# EAGLE design OpenSprinkler_v12 (EAGLE 5.11)
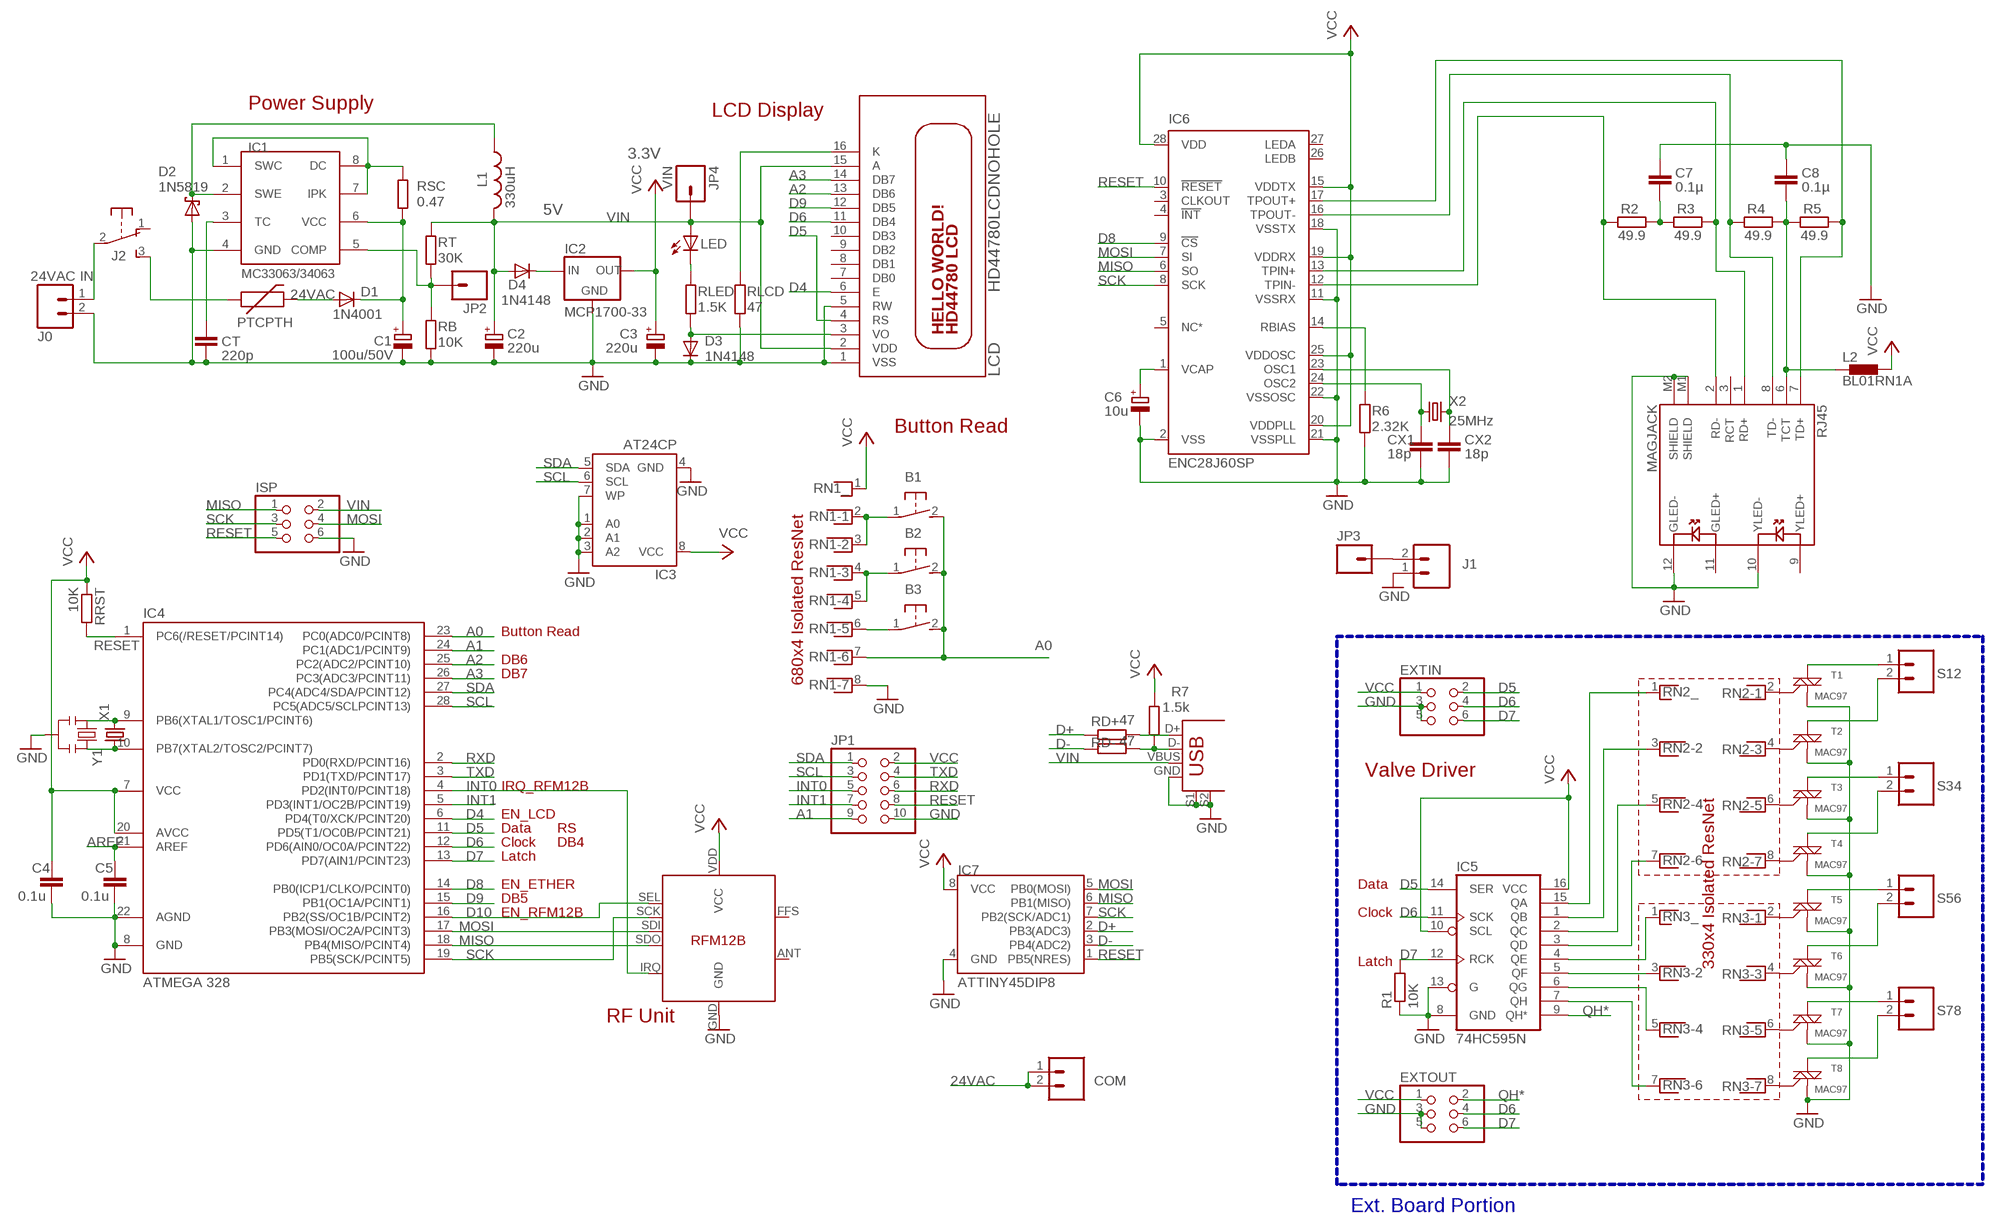
[diagram p0: schematic, sheet 1]

## Parts
B1  31-XX  [B3F-31XX]
B2  31-XX  [B3F-31XX]
B3  31-XX  [B3F-31XX]
C1  100u/50V  CPOL-EUE3.5-8  [E3,5-8]
C2  220u  CPOL-EUE2-5  [E2-5]
C3  220u  CPOL-EUE2-5  [E2-5]
C4  0.1u  C-EU025-024X044  [C025-024X044]
C5  0.1u  C-EU025-024X044  [C025-024X044]
C6  10u  CPOL-EUE1.8-4  [E1,8-4]
C7  0.1µ  C-EU025-024X044  [C025-024X044]
C8  0.1µ  C-EU025-024X044  [C025-024X044]
COM  M025MM  [SCREWTERMINAL-5MM-2]
CT  220p  C-EU025-024X044  [C025-024X044]
CX1  18p  C-EU025-024X044  [C025-024X044]
CX2  18p  C-EU025-024X044  [C025-024X044]
D1  1N4001  DIODE-DO41-7.6  [DO41-7.6]
D2  1N5819  1N5817-B  [DO41-7.6]
D3  1N4148  1N4148DO35-7  [DO35-7]
D4  1N4148  1N4148DO35-7  [DO35-7]
EXTIN  PINHD-2X3  [2X03]
EXTOUT  PINHD-2X3  [2X03]
IC1  MC33063/MC34063P  [DIL08]
IC2  MCP1700-33  MCP1700INLINE  [TO92-INLINE]
IC3  AT24CP  [DIL08]
IC4  ATMEGA 328  ATMEGA48/88/168-PU  [DIL28-3]
IC5  74HC595N  74LS595N  [DIL16]
IC6  ENC28J60SP  [DIL28-3]
IC7  ATTINY45DIP8  [DIP08]
IC8  RFM12B  [RFM12B]
ISP  PINHD-2X3  [2X03]
J0  24VAC IN  M025MM  [SCREWTERMINAL-5MM-2]
J1  M025MM  [SCREWTERMINAL-5MM-2]
J2  EG1206  [EG1206]
JP1  PINHD-2X5  [2X05]
JP2  M01PTH  [1X01]
JP3  M01PTH  [1X01]
JP4  VIN  M01PTH  [1X01]
L1  330uH  L-US6000-XXX-RC  [6000-XXXX-RC]
L2  BL01RN1A  [BL01RN1A]
LCD  HD44780LCDNOHOLE  [LCD1602A]
LED  POWERLED  LED3MM  [LED3MM]
PTC  PTCPTH  [PTC]
R1  10K  R-EU_0204/7  [0204/7]
R2  49.9  R-EU_0204/7  [0204/7]
R3  49.9  R-EU_0204/7  [0204/7]
R4  49.9  R-EU_0204/7  [0204/7]
R5  49.9  R-EU_0204/7  [0204/7]
R6  2.32K  R-EU_0204/7  [0204/7]
R7  1.5k  R-EU_0204/7  [0204/7]
RB  10K  R-EU_0204/7  [0204/7]
RD+  47  R-EU_0204/7  [0204/7]
RD-  47  R-EU_0204/7  [0204/7]
RJ45  MAGJACK  [MAGJACK]
RLCD  47  R-EU_0204/7  [0204/7]
RLED  1.5K  R-EU_0204/7  [0204/7]
RN1  RNX7  [RN-8]
RN2  RNX7  [RN-8]
RN3  RNX7  [RN-8]
RRST  10K  R-EU_0204/7  [0204/7]
RSC  0.47  R-EU_0204/2V  [0204V]
RT  30K  R-EU_0204/7  [0204/7]
S12  M025MM  [SCREWTERMINAL-5MM-2]
S34  M025MM  [SCREWTERMINAL-5MM-2]
S56  M025MM  [SCREWTERMINAL-5MM-2]
S78  M025MM  [SCREWTERMINAL-5MM-2]
T1  MAC97  LX807DE  [TO-92]
T2  MAC97  LX807DE  [TO-92]
T3  MAC97  LX807DE  [TO-92]
T4  MAC97  LX807DE  [TO-92]
T5  MAC97  LX807DE  [TO-92]
T6  MAC97  LX807DE  [TO-92]
T7  MAC97  LX807DE  [TO-92]
T8  MAC97  LX807DE  [TO-92]
USB  USB+SHIELD  [USB-B-PTH]
X1  CRYSTALTC26V  [TC26V]
X2  25MHz  CRYSTALHC49US  [HC49US]
Y1  RESONATORPTH  [RESONATOR-PTH]

## Nets
24VAC [power]: COM.1 COM.2 D1.A PTC.P$2
A0: B1.2(S) B2.2(S) B3.2(S) IC4.23(PC0(ADC0/PCINT8)) RN1.7
A1: IC4.24(PC1(ADC1/PCINT9)) JP1.9
A2: IC4.25(PC2(ADC2/PCINT10)) LCD.13(DB6)
A3: IC4.26(PC3(ADC3/PCINT11)) LCD.14(DB7)
AREF: C5.1 IC4.21(AREF)
D4: IC4.6(PD4(T0/XCK/PCINT20)) LCD.6(E)
D5: EXTIN.2 IC4.11(PD5(T1/OC0B/PCINT21)) IC5.14(SER) LCD.4(RS)
D6: EXTIN.4 EXTOUT.4 IC4.12(PD6(AIN0/OC0A/PCINT22)) IC5.11(SCK) LCD.11(DB4)
D7: EXTIN.6 EXTOUT.6 IC4.13(PD7(AIN1/PCINT23)) IC5.12(RCK) R1.2
D8: IC4.14(PB0(ICP1/CLKO/PCINT0)) IC6.9(!CS)
D9: IC4.15(PB1(OC1A/PCINT1)) LCD.12(DB5)
D10: IC4.16(PB2(SS/OC1B/PCINT2)) IC8.SEL
D+: IC7.2(PB3(ADC3)) RD+.1
D-: IC7.3(PB4(ADC2)) RD-.1
GND [power]: C1.- C2.- C3.- C4.2 C5.2 C6.- C7.1 C8.1 CT.2 CX1.2 CX2.2 D2.A D3.C EXTIN.3 EXTIN.5 EXTOUT.3 EXTOUT.5 IC1.4(GND) IC2.1(GND) IC3.1(A0) IC3.2(A1) IC3.3(A2) IC3.4(GND) IC3.7(WP) IC4.8(GND) IC4.22(AGND) IC5.8(GND) IC5.13(G) IC6.2(VSS) IC6.11(VSSRX) IC6.18(VSSTX) IC6.21(VSSPLL) IC6.22(VSSOSC) IC7.4(GND) IC8.GND ISP.6 J0.2 J1.1 JP1.10 LCD.1(VSS) LCD.5(RW) R1.1 R6.2 RB.2 RJ45.10(YLED-) RJ45.12(GLED-) RJ45.M1(SHIELD) RJ45.M2(SHIELD) RLCD.2 RN1.8 T1.1(M1) T2.1(M1) T3.1(M1) T4.1(M1) T5.1(M1) T6.1(M1) T7.1(M1) T8.1(M1) USB.GND USB.S1 USB.S2 Y1.2
INT0: IC4.4(PD2(INT0/PCINT18)) IC8.IRQ JP1.5
INT1: IC4.5(PD3(INT1/OC2B/PCINT19)) JP1.7
MISO: IC4.18(PB4(MISO/PCINT4)) IC6.6(SO) IC7.6(PB1(MISO)) IC8.SDO ISP.1
MOSI: IC4.17(PB3(MOSI/OC2A/PCINT3)) IC6.7(SI) IC7.5(PB0(MOSI)) IC8.SDI ISP.4
N$2: IC4.9(PB6(XTAL1/TOSC1/PCINT6)) X1.2 Y1.1
N$3: RN2.2 T1.2(G)
N$4: IC5.5(QF) RN3.3
N$5: IC5.6(QG) RN3.5
N$6 [power]: J0.1 J2.2(P)
N$7: IC5.7(QH) RN3.7
N$8: IC4.10(PB7(XTAL2/TOSC2/PCINT7)) X1.1 Y1.3
N$9 [power]: C1.+ D1.C IC1.6(VCC) RSC.2
N$10: IC5.4(QE) RN3.1
N$11: IC5.3(QD) RN2.7
N$12: IC5.2(QC) RN2.5
N$13: IC5.1(QB) RN2.3
N$14: IC5.15(QA) RN2.1
N$15: RN2.4 T2.2(G)
N$16 [power]: S12.1 T1.3(M2)
N$17 [power]: S12.2 T2.3(M2)
N$18 [power]: S34.1 T3.3(M2)
N$19: RN2.6 T3.2(G)
N$20 [power]: S34.2 T4.3(M2)
N$21: RN2.8 T4.2(G)
N$22 [power]: S56.1 T5.3(M2)
N$23 [power]: S56.2 T6.3(M2)
N$24 [power]: S78.1 T7.3(M2)
N$25 [power]: S78.2 T8.3(M2)
N$26: RN3.2 T5.2(G)
N$27: RN3.4 T6.2(G)
N$28: RN3.6 T7.2(G)
N$29: RN3.8 T8.2(G)
N$30: C8.2 L2.1 R4.2 R5.1 RJ45.6(TCT)
N$31 [power]: J2.3(S) PTC.P$1
N$32: B1.1(P) RN1.2 RN1.3
N$33: B3.1(P) RN1.6
N$34: D4.C IC2.2(IN)
N$35: B2.1(P) RN1.4 RN1.5
N$36: LED.K(C) RLED.1
N$38: RD+.2 USB.D+
N$39: D3.A LCD.3(VO) RLED.2
N$40 [power]: IC1.1(SWC) IC1.7(IPK) IC1.8(DC) RSC.1
N$41: IC6.17(TPOUT+) R5.2 RJ45.7(TD+)
N$42: IC6.16(TPOUT-) R4.1 RJ45.8(TD-)
N$43: IC6.13(TPIN+) R3.2 RJ45.1(RD+)
N$44: IC6.12(TPIN-) R2.1 RJ45.2(RD-)
N$45: R7.1 RD-.2 USB.D-
N$46 [power]: D2.C IC1.2(SWE) L1.1
N$47: J1.2 JP3.1
N$48: LCD.16(K) RLCD.1
N$49: CT.1 IC1.3(TC)
N$50: C6.+ IC6.1(VCAP)
N$51: IC6.14(RBIAS) R6.1
N$52: CX1.1 IC6.24(OSC2) X2.1
N$53: CX2.1 IC6.23(OSC1) X2.2
N$54: C7.2 R2.2 R3.1
N$55: IC1.5(COMP) JP2.1 RB.1 RT.2
QH*: EXTOUT.2 IC5.9(QH*)
RESET: IC4.1(PC6(/RESET/PCINT14)) IC6.10(!RESET) IC7.1(PB5(NRES)) ISP.5 JP1.8 RRST.2
RXD: IC4.2(PD0(RXD/PCINT16)) JP1.6
SCK: IC4.19(PB5(SCK/PCINT5)) IC6.8(SCK) IC7.7(PB2(SCK/ADC1)) IC8.SCK ISP.3
SCL: IC3.6(SCL) IC4.28(PC5(ADC5/SCLPCINT13)) JP1.3
SDA: IC3.5(SDA) IC4.27(PC4(ADC4/SDA/PCINT12)) JP1.1
TXD: IC4.3(PD1(TXD/PCINT17)) JP1.4
VCC: C3.+ C4.1 EXTIN.1 EXTOUT.1 IC2.3(OUT) IC3.8(VCC) IC4.7(VCC) IC4.20(AVCC) IC5.10(SCL) IC5.16(VCC) IC6.15(VDDTX) IC6.19(VDDRX) IC6.20(VDDPLL) IC6.25(VDDOSC) IC6.28(VDD) IC7.8(VCC) IC8.VDD(VCC) JP1.2 L2.2 R7.2 RN1.1 RRST.1
VIN: C2.+ D4.A ISP.2 JP4.1 L1.2 LCD.2(VDD) LCD.15(A) LED.A RT.1 USB.VBUS
Unconnected: IC6.3(CLKOUT) IC6.4(!INT) IC6.5(NC*) IC6.26(LEDB) IC6.27(LEDA) IC8.ANT IC8.FFS J2.1(O) LCD.7(DB0) LCD.8(DB1) LCD.9(DB2) LCD.10(DB3) RJ45.3(RCT) RJ45.9(YLED+) RJ45.11(GLED+)

## Buses
B$1

## Notes on the sheet
- Power Supply
- LCD Display
- 3.3V
- 5V
- Button Read
- Button Read
- DB6
- DB7
- 680x4 Isolated ResNet
- Valve Driver
- IRQ_RFM12B
- 330x4 Isolated ResNet
- EN_LCD
- Data | RS
- Clock | DB4
- Latch
- EN_ETHER | Data
- DB5
- EN_RFM12B | Clock
- Latch
- RF Unit
- Ext. Board Portion

## Library data of the parts
B1-B3 = adafruit:31-XX: OMRON SWITCH Now with beefier pads!
C1-C3 C6 = resistor:CPOL-EU: POLARIZED CAPACITOR, European symbol
C4 C5 CT = rcl:C-EU: CAPACITOR, European symbol
C7 C8 CX1 CX2 = resistor:C-EU: CAPACITOR, European symbol
COM J0 J1 S12 S34 S56 S78 = SparkFun:M02: Header 2 Standard 2-pin 0.1" header. Use with straight break away headers (SKU : PRT-00116), right angle break away headers (PRT-00553), swiss pins (PRT-00743), machine pins (PRT-00117), and female headers (PRT-00115). Molex polarized connector foot print use with SKU : PRT-08233 with associated crimp pins and housings.
D1 = diode:DIODE-: DIODE
D2 = diode:1N581*: 1.0A SCHOTTKY BARRIER RECTIFIER Source: http://www.diodes.com/datasheets/ds23001.pdf
D3 D4 = diode:1N4148: DIODE high speed (Philips)
EXTIN EXTOUT ISP = pinhead:PINHD-2X3: PIN HEADER
IC1 = adafruit:MC33063/MC34063: MC33063 and MC34063 Basic DC/DC converter with internal power-NPN transistor, 100KHz, 1.5A peak switch current. 3-40 input/output.
IC2 = adafruit:MCP1700: VOLTAGE REGULATOR
IC3 = atmel:AT24C*: 2-wire serial EEPROM; MPN: AT24C1024BW-SH-B; OC_FARNELL: 1362646; OC_NEWARK: 03P2044
IC4 = atmega8:ATMEGA48/88/168-PU
IC5 = SparkFun:74*595: 8-bit SHIFT REGISTER, output latch
IC6 = microchip:ENC28J60: Stand-Alone Ethernet Controller with SPI Interface Source: http://ww1.microchip.com/downloads/en/DeviceDoc/39662c.pdf; MF: MICROCHIP; MPN: ENC28J60/SP; OC_FARNELL: 1084619; OC_NEWARK: 96K3661
IC7 = SparkFun:ATTINY45: Atmel ATTiny45
IC8 = JeeLabs:RFM12B
J2 = adafruit:EG1206
JP1 = pinhead:PINHD-2X5: PIN HEADER
JP2-JP4 = SparkFun:M01: Header 1 Standard 1-pin 0.1" header. Use with straight break away headers (SKU : PRT-00116), right angle break away headers (PRT-00553), swiss pins (PRT-00743), machine pins (PRT-00117), and female headers (PRT-00115).
L1 = rcl:L-US: INDUCTOR, American symbol
L2 = inductors:BL0: Noise Suppression Products/EMI Suppression Filters, Lead EMIFIL(R) Inductor Type Source: http://www.murata.com .. BL01RN1_DS.pdf
LCD = adafruit:HD44780LCD: HD44780 LCD Standard character type LCDs, available in sizes from 8x1 to 40x4!
LED = adafruit:LED: LED OSRAM: - CHIPLED LG R971, LG N971, LY N971, LG Q971, LY Q971, LO R971, LY R971 LH N974, LH R974 LS Q976, LO Q976, LY Q976 LO Q996 - Hyper CHIPLED LW Q18S LB Q993, LB Q99A, LB R99A - SideLED LS A670, LO A670, LY A670, LG A670, LP A670 LB A673, LV A673, LT A673, LW A673 LH A674 LY A675 LS A676, LA A676, LO A676, LY A676, LW A676 LS A679, LY A679, LG A679 - Hyper Micro SIDELED® LS Y876, LA Y876, LO Y876, LY Y876 LT Y87S - SmartLED LW L88C, LW L88S LB L89C, LB L89S, LG L890 LS L89K, LO L89K, LY L89K LS L896, LA L896, LO L896, LY L896 - TOPLED LS T670, LO T670, LY T670, LG T670, LP T670 LSG T670, LSP T670, LSY T670, LOP T670, LYG T670 LG T671, LOG T671, LSG T671 LB T673, LV T673, LT T673, LW T673 LH T674 LS T676, LA T676, LO T676, LY T676, LB T676, LH T676, LSB T676, LW T676 LB T67C, LV T67C, LT T67C, LS T67K, LO T67K, LY T67K, LW E67C LS E67B, LA E67B, LO E67B, LY E67B, LB E67C, LV E67C, LT E67C LW T67C LS T679, LY T679, LG T679 LS T770, LO T770, LY T770, LG T770, LP T770 LB T773, LV T773, LT T773, LW T773 LH T774 LS E675, LA E675, LY E675, LS T675 LS T776, LA T776, LO T776, LY T776, LB T776 LHGB T686 LT T68C, LB T68C - Hyper Mini TOPLED® LB M676 - Mini TOPLED Santana® LG M470 LS M47K, LO M47K, LY M47K Source: http://www.osram.convergy.de/
PTC = SparkFunNew:PTC: Resettable Fuse PTC Resettable Fuse. Spark Fun Electronics SKU : COM-08357
R1-R7 RB RD+ RD- RLCD RLED RRST RSC RT = rcl:R-EU_: RESISTOR, European symbol
RJ45 = SparkFunNew:MAGJACK
RN1-RN3 = resistor-net:RNX7: RESISTOR NETWORK; OC_FARNELL: unknown; OC_NEWARK: unknown
T1-T8 = SparkFun:LX807DE: LX807DE Triac http://www.littelfuse.com/data/en/Data_Sheets/Littelfuse_Triac_LX8.pdf
USB = SparkFunNew:USB+SHIELD: USB+Shield USB connector with shield pins connectable
X1 = crystal:CRYSTAL: CRYSTAL; OC_FARNELL: unknown; OC_NEWARK: unknown
X2 = SparkFun:CRYSTAL: Crystals Various standard crystals. Proven footprints. Spark Fun Electronics SKU : COM-00534
Y1 = SparkFun:RESONATOR: Resonator Small SMD resonator. This is the itty bitty 10/20MHz resonators with built in caps. CSTCE10M0G55 and CSTCE20M0V53. Footprint has been reviewed closely but hasn't been tested yet.

## Net classes
0 default: width 0.406 mm, clearance 0.203 mm
1 power: width 0.813 mm, clearance 0.203 mm

## Board
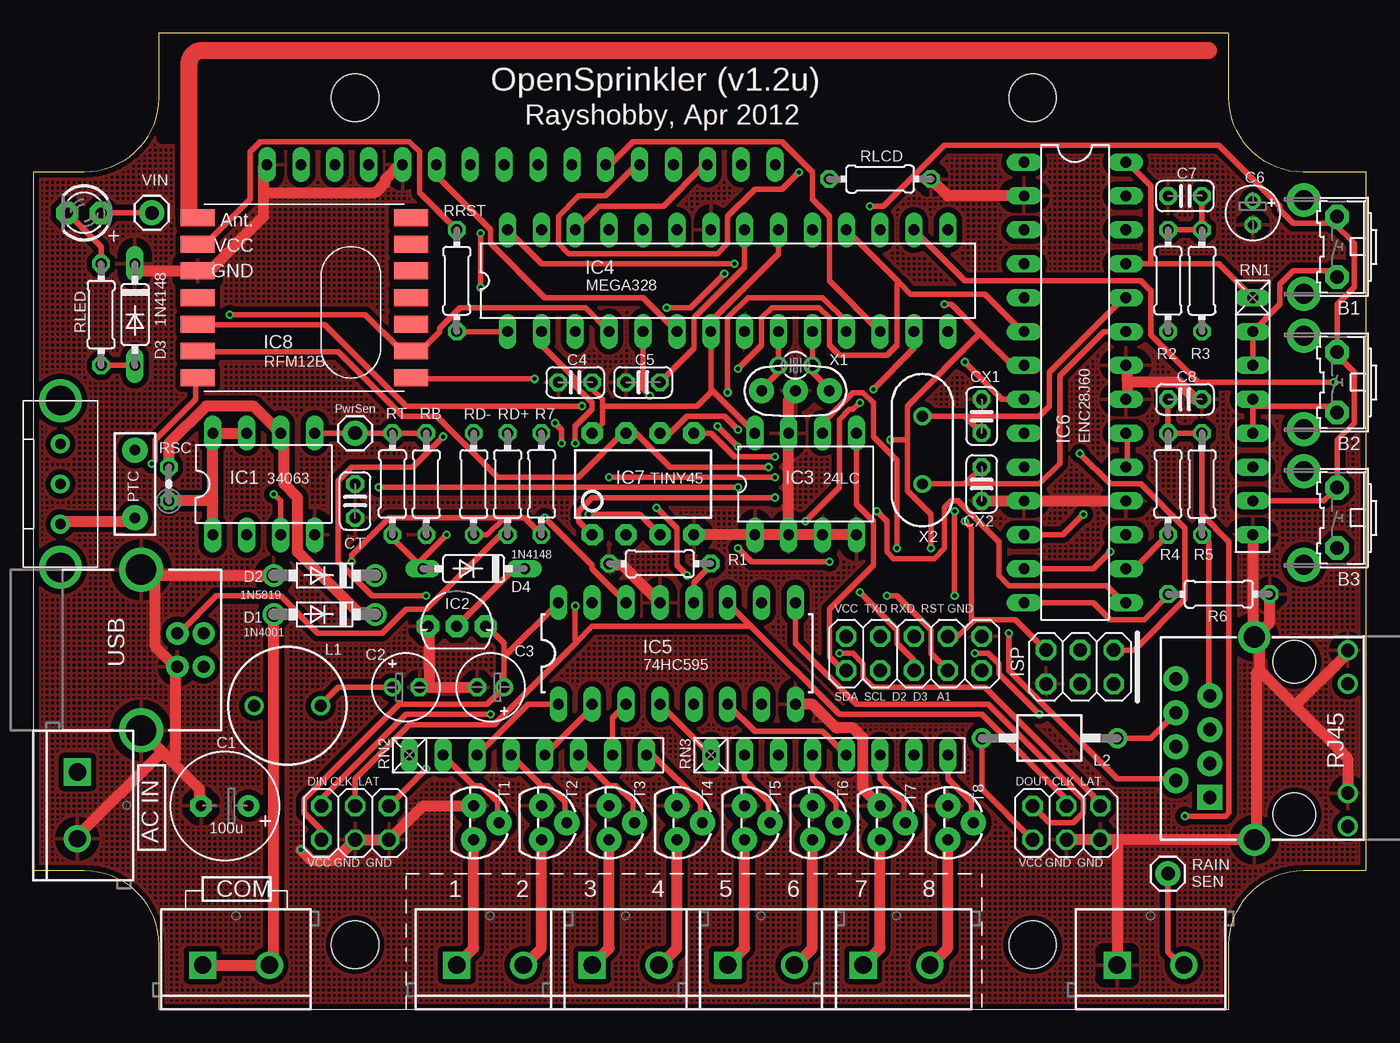
[diagram p1: board, top side]
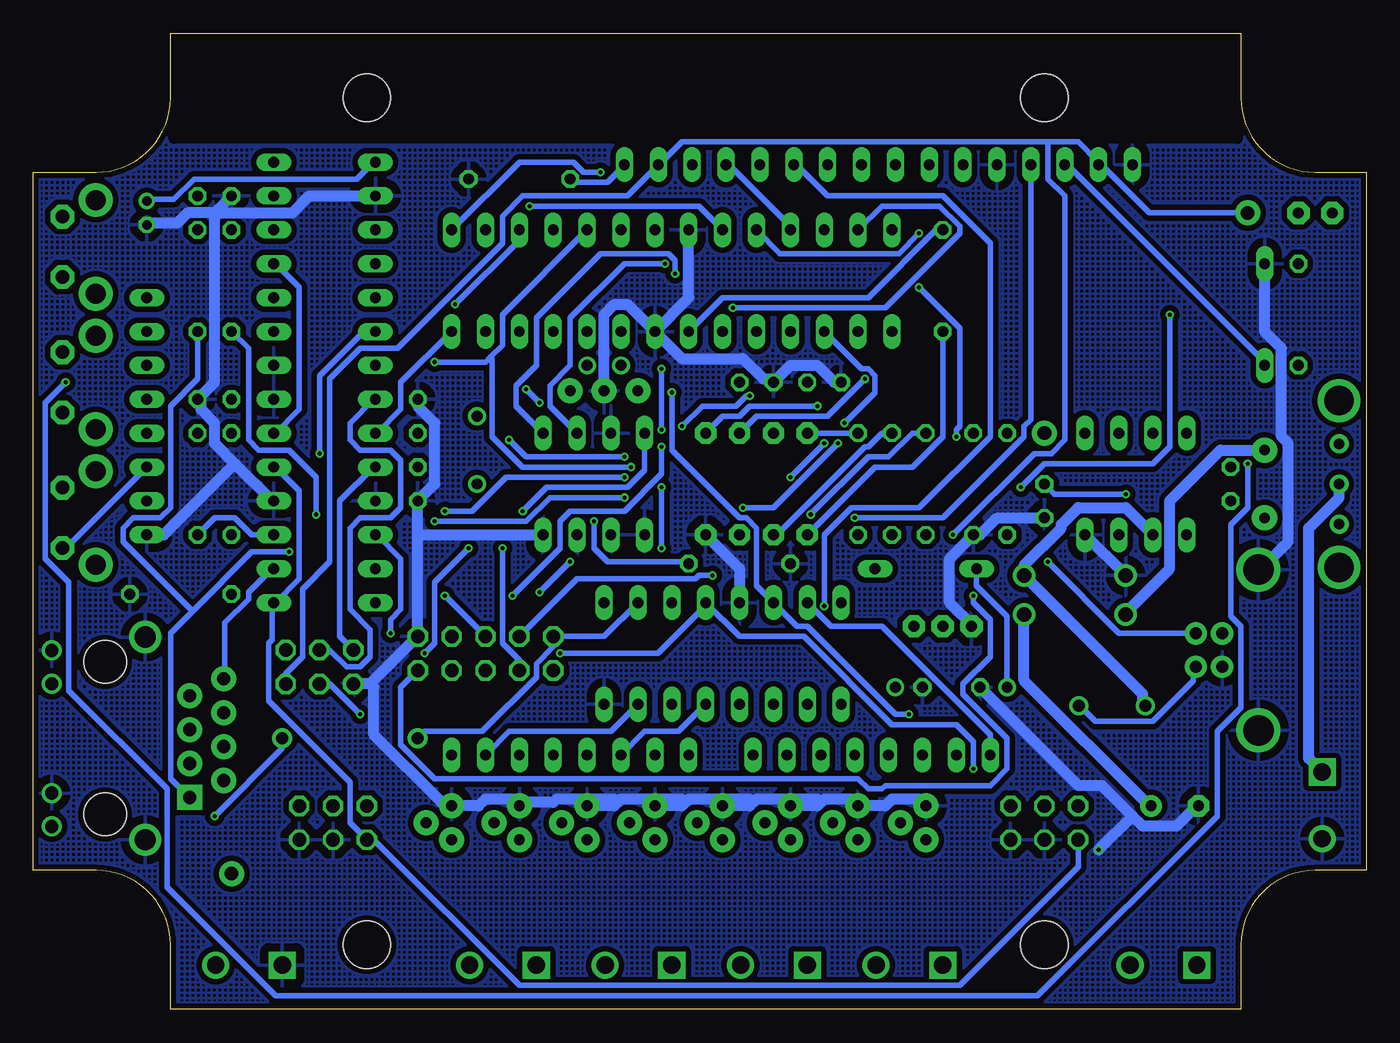
[diagram p2: board, bottom side, seen from below]

Size 99.95 x 73.15 mm. Coordinates in mm from the lower left corner, seen from the top.
Outline: 9.4,0 89.66,0 89.66,4.83 arc-90 95.25,10.41 99.95,10.41 99.95,62.74 95.25,62.74 arc-90 89.66,68.33 89.66,73.15 9.4,73.15 9.4,68.33 arc-90 3.81,62.74 0,62.74 0,10.41 3.81,10.41 arc-90 9.4,4.83 9.4,0
Copper layers (1*16): Top 0.035mm / dielectric 1.5mm / Bottom 0.035mm
Design rules "Fusion_eagle_rule_v1.1 *": minimum track width 6mil, minimum drill 12mil, track to track 6mil, track to pad 6mil, pad to pad 8mil, via to via 8mil, smd to smd 0mil, copper to edge 10mil, drill to drill 10mil, minimum pad ring 10mil, minimum via ring 6mil, stop-mask expansion 2mil, vias tented up to drill 100mil, thermal gap 25mil
Holes 3.56 mm at 24.13,4.83 74.93,4.83 24.13,68.33 74.93,68.33
tRestrict: area 9.7,65.3 to 89.4,72.6
bRestrict: area 9.7,65.3 to 89.4,72.6
vRestrict: area 21.6,2.3 to 26.7,7.4; area 72.4,2.3 to 77.5,7.4; area 73.7,16.8 to 81.3,17.5; area 73.7,10.7 to 81.3,11.4; area 64.8,36.8 to 68.6,47; area 59.9,29.5 to 71.9,30.5; area 59.9,22.9 to 71.9,23.9; area 86.9,9.1 to 89.7,11.2; area 20.3,16.8 to 27.9,17.5; area 20.3,10.7 to 27.9,11.4; area 26.4,44.2 to 30.2,45; area 32.3,44.2 to 38.9,45

### Footprints (pad centres in the part's own frame; a part is rotated, then mirrored left to right if it is on the bottom)
B3F-31XX = drill 1.016 pad 1.778 octagon: 1 -2.261,-1.245; 2 2.261,-1.245 | drill 1.499 pad 2.54 round: 3 -3.505,1.245; 4 3.505,1.245
E3,5-8 = drill 0.813 pad 1.6 round: + -1.778,0 | drill 0.813 pad 1.6 octagon: - 1.778,0
E2-5 = drill 0.813 pad 1.27 round: + -1.016,0 | drill 0.813 pad 1.27 octagon: - 1.016,0
C025-024X044 = drill 0.813 octagon: 1 -1.27,0; 2 1.27,0
E1,8-4 = drill 0.711 pad 1.168 round: + -0.889,0 | drill 0.711 pad 1.168 octagon: - 0.889,0
SCREWTERMINAL-5MM-2 = drill 1.3 pad 2.032 square: 1 0,0 | drill 1.3 pad 2.032 round: 2 5,0
DO41-7.6 = drill 1.1 pad 1.7 round: A 3.81,0; C -3.81,0
DO35-7 = drill 0.813 long: A 3.81,0; C -3.81,0
2X03 = drill 1.016 octagon: 1 -2.54,-1.27; 2 -2.54,1.27; 3 0,-1.27; 4 0,1.27; 5 2.54,-1.27; 6 2.54,1.27
DIL08 = drill 0.813 long: 1 -3.81,-3.81; 2 -1.27,-3.81; 3 1.27,-3.81; 4 3.81,-3.81; 5 3.81,3.81; 6 1.27,3.81; 7 -1.27,3.81; 8 -3.81,3.81
TO92-INLINE = drill 0.813 pad 1.676 octagon: 1 -2.159,0; 2 0,0; 3 2.159,0
DIL28-3 = drill 0.813 long: 1 -16.51,-3.81; 2 -13.97,-3.81; 3 -11.43,-3.81; 4 -8.89,-3.81; 5 -6.35,-3.81; 6 -3.81,-3.81; 7 -1.27,-3.81; 8 1.27,-3.81; 9 3.81,-3.81; 10 6.35,-3.81; 11 8.89,-3.81; 12 11.43,-3.81; 13 13.97,-3.81; 14 16.51,-3.81; 15 16.51,3.81; 16 13.97,3.81; 17 11.43,3.81; 18 8.89,3.81; 19 6.35,3.81; 20 3.81,3.81; 21 1.27,3.81; 22 -1.27,3.81; 23 -3.81,3.81; 24 -6.35,3.81; 25 -8.89,3.81; 26 -11.43,3.81; 27 -13.97,3.81; 28 -16.51,3.81
DIL16 = drill 0.813 long: 1 -8.89,-3.81; 2 -6.35,-3.81; 3 -3.81,-3.81; 4 -1.27,-3.81; 5 1.27,-3.81; 6 3.81,-3.81; 7 6.35,-3.81; 8 8.89,-3.81; 9 8.89,3.81; 10 6.35,3.81; 11 3.81,3.81; 12 1.27,3.81; 13 -1.27,3.81; 14 -3.81,3.81; 15 -6.35,3.81; 16 -8.89,3.81
DIP08 = drill 0.813 pad 1.6 octagon: 1 -3.81,-3.81; 2 -1.27,-3.81; 3 1.27,-3.81; 4 3.81,-3.81; 5 3.81,3.81; 6 1.27,3.81; 7 -1.27,3.81; 8 -3.81,3.81
RFM12B = smd 2.54 x 1.27: ANT 8,-6; FFS -8,2; GND 8,-2; IRQ -8,4; P$8 -8,0; P$9 -8,-2; P$10 -8,-4; P$12 -8,-6; P$16 8,0; SCK 8,4; SDI 8,2; SDO -8,6; SEL 8,6; VDD 8,-4
EG1206 = drill 0.8 pad 1.422 round: 1 -3,0; 2 0,0; 3 3,0 | drill 2.2 round: MT1 -6.25,0; MT2 6.25,0
2X05 = drill 1.016 octagon: 1 -5.08,-1.27; 2 -5.08,1.27; 3 -2.54,-1.27; 4 -2.54,1.27; 5 0,-1.27; 6 0,1.27; 7 2.54,-1.27; 8 2.54,1.27; 9 5.08,-1.27; 10 5.08,1.27
1X01 = drill 1.016 pad 1.88 round: 1 0,0
6000-XXXX-RC = drill 0.9 pad 1.422 round: 1 -2.5,0; 2 2.5,0
BL01RN1A = drill 0.9 pad 1.5 round: 1 -5.08,0; 2 5.08,0
LCD1602A = drill 0.8 long: 1 8,33.46; 2 10.54,33.46; 3 13.08,33.46; 4 15.62,33.46; 5 18.16,33.46; 6 20.7,33.46; 7 23.24,33.46; 8 25.78,33.46; 9 28.32,33.46; 10 30.86,33.46; 11 33.4,33.46; 12 35.94,33.46; 13 38.48,33.46; 14 41.02,33.46; 15 43.56,33.46; 16 46.1,33.46
LED3MM = drill 0.813 pad 1.676 octagon: A -1.27,0; K 1.27,0
PTC = drill 0.8 pad 1.88 round: P$1 -2.54,0; P$2 2.54,0
0204/7 = drill 0.813 octagon: 1 -3.81,0; 2 3.81,0
MAGJACK = drill 1 pad 1.88 square: 1 3.175,17.445 | drill 1 pad 1.88 round: 2 4.445,19.985; 3 5.715,17.445; 4 6.985,19.985; 5 8.255,17.445; 6 9.525,19.985; 7 10.795,17.445; 8 12.065,19.985 | drill 1 pad 1.27 round: 9 1,7.1; 10 3.5,7.1; 11 11.7,7.1; 12 14.2,7.1 | drill 1.6 pad 2.184 round: M1 0,14.1; M2 15.2,14.1 | hole 3.2: 1.905,11.095; 13.335,11.095
RN-8 = drill 0.813 long: 1 -8.89,0; 2 -6.35,0; 3 -3.81,0; 4 -1.27,0; 5 1.27,0; 6 3.81,0; 7 6.35,0; 8 8.89,0
0204V = drill 0.813 octagon: 1 -1.27,0; 2 1.27,0
TO-92 = drill 0.813 pad 1.88 round: 1 -1.27,0; 2 0,1.905; 3 1.27,0
USB-B-PTH = drill 0.914 pad 1.676 round: D+ 0,1.25; D- 1.981,1.25; GND 0,-1.25; VBUS 1.981,-1.25 | drill 2.286 round: S1 -2.718,-6.02; S2 -2.718,6.02
TC26V = drill 0.813 round: 1 -1.27,0; 2 1.27,0
HC49US = drill 0.813 round: 1 -2.54,0; 2 2.54,0
RESONATOR-PTH = drill 0.8 pad 1.88 round: 1 -2.54,0; 2 0,0; 3 2.54,0

### Placement (x,y rotation side)
B1  96.52,57.15 90 top
B2  96.52,46.99 90 top
B3  96.52,36.83 90 top
C1  14.35,15.24 180 top
C2  27.94,24.13 0 top
C3  34.29,24.13 180 top
C4  40.64,46.99 180 top
C5  45.72,46.99 180 top
C6  91.44,59.69 270 top
C7  86.36,60.96 0 top
C8  86.36,45.72 180 top
COM  12.7,3.3 0 top
CT  24.13,38.1 270 top
CX1  71.12,44.45 90 top
CX2  71.12,39.37 270 top
D1  21.84,29.59 180 top
D2  21.84,32.51 180 top
D3  7.62,52.07 270 top
D4  33.02,33.02 180 top
EXTIN  24.13,13.97 0 top
EXTOUT  77.47,13.97 0 top
IC1  17.27,39.37 0 top
IC2  31.75,28.7 0 top
IC3  57.91,39.37 0 top
IC4  52.07,54.61 0 top
IC5  48.26,26.67 0 top
IC6  78.11,46.99 270 top
IC7  45.72,39.37 0 top
IC8  20.32,53.34 180 top
ISP  78.49,25.65 180 top
J0  3.3,17.78 270 top
J1  81.28,3.3 0 top
J2  2.03,39.37 270 top
JP1  66.04,26.67 0 top
JP2  24.13,43.18 0 top
JP3  85.09,10.16 0 top
JP4  8.89,59.69 0 top
L1  19.05,22.73 0 top
L2  76.2,20.32 180 top
LCD  9.53,29.84 0 top
LED  3.81,59.69 180 top
PTC  7.62,39.37 90 top
R1  46.99,33.4 0 top
R2  85.09,54.61 90 top
R3  87.63,54.61 270 top
R4  85.09,39.37 90 top
R5  87.63,39.37 270 top
R6  88.9,31.11 0 top
R7  38.1,39.37 90 top
RB  29.46,39.37 270 top
RD+  35.56,39.37 270 top
RD-  33.02,39.37 270 top
RJ45  105.66,12.7 90 top
RLCD  63.5,62.23 0 top
RLED  5.08,52.07 270 top
RN1  91.44,44.45 270 top
RN2  37.08,19.05 0 top
RN3  59.69,19.05 0 top
RRST  31.75,54.61 270 top
RSC  10.16,39.37 90 top
RT  26.92,39.37 90 top
S12  31.75,3.3 0 top
S34  41.91,3.3 0 top
S56  52.07,3.3 0 top
S78  62.23,3.3 0 top
T1  33.02,13.97 270 top
T2  38.1,13.97 270 top
T3  43.18,13.97 270 top
T4  48.26,13.97 270 top
T5  53.34,13.97 270 top
T6  58.42,13.97 270 top
T7  63.5,13.97 270 top
T8  68.58,13.97 270 top
USB  10.79,26.92 0 top
X1  57.15,48.26 180 top
X2  66.67,41.91 270 top
Y1  57.15,46.35 0 top

### Tracks (layer width: path | path; a pad name or v marks a point on that pad's centre or on a via)
24VAC
  Top 0.813: D1.A 18.03,3.56 17.78,3.3 COM.2 COM.1
  Bottom 0.813: PTC.P$2 10.92,41.91 14.73,38.1 14.73,33.02 18.03,29.72 D1.A
A0  (via drill 0.3)
  Top 0.406: RN1.7 96.77,38.1 B3.2 97.79,39.12 97.79,42.67 99.06,43.94 99.06,47.75 97.79,49.02 B2.2 97.79,49.28 97.79,52.83 99.06,54.1 99.06,57.4 97.54,58.93 B1.2 97.28,58.93 94.49,58.93 93.47,59.94 93.47,60.2 88.9,64.77 68.33,64.77 63.75,60.2 v62.74,60.2
  Bottom 0.406: IC4.23 50.04,60.2 v62.74,60.2
A1  (via drill 0.3)
  Top 0.406: v33.53,54.1 v33.53,58.17 | v30.73,42.93 28.45,40.64 23.88,40.64 22.86,39.62 22.86,33.53 25.4,30.99 v29.46,30.99
  Bottom 0.406: IC4.24 43.94,56.64 35.05,56.64 v33.53,58.17 | v33.53,54.1 30.48,51.05 30.48,43.69 30.73,43.43 v30.73,42.93 | v29.46,30.99 29.46,30.48 28.19,29.21 28.19,26.42 30.23,24.38 30.23,23.62 26.92,20.32 26.92,18.03 28.19,16.76 36.07,16.76 36.32,16.51 37.34,16.51 38.1,17.27 69.85,17.27 72.39,19.81 72.39,24.13 JP1.9
A2
  Bottom 0.406: IC4.25 43.18,58.67 47.75,63.25 LCD.13
A3
  Top 0.406: IC4.26 42.42,60.2 47.24,60.2 50.29,63.25 LCD.14
AREF
  Top 0.406: C5.1 49.53,49.53 49.53,51.82 53.34,55.63 IC4.21
D4
  Top 0.406: IC4.6 45.72,53.34 38.35,53.34 34.29,57.4 34.29,58.42 30.23,62.48 30.23,63.25 LCD.6
D5  (via drill 0.3)
  Top 0.406: v38.35,36.83 41.91,33.27 41.91,33.02 IC5.14 | IC4.11 60.96,51.56 59.18,53.34 53.59,53.34 52.07,51.82 v52.07,46.23 | EXTIN.2 21.59,15.75 27.94,22.1 v34.29,22.1
  Bottom 0.406: v38.35,36.83 31.75,36.83 25.65,42.93 25.65,43.69 25.15,44.2 25.15,63.25 LCD.4 | v52.07,46.23 52.07,41.91 46.99,36.83 46.48,36.83 45.72,36.07 45.72,31.75 IC5.14 42.67,28.7 41.91,28.7 35.31,22.1 v34.29,22.1
D6  (via drill 0.3)
  Top 0.406: IC4.12 59.69,54.61 59.69,59.44 58.42,60.71 58.42,62.74 56.13,65.02 44.96,65.02 43.43,63.5 42.93,63.5 LCD.11 | 53.72,28.83 60.45,22.1 71.12,22.1 77.47,15.75 EXTOUT.4 | 53.72,28.83 IC5.11 | EXTIN.4 24.13,17.27 28.19,21.34 34.54,21.34 40.77,27.56 | 40.77,27.56 41.91,28.7 53.59,28.7 53.72,28.83 | v40.64,30.23 40.64,27.69 40.77,27.56
  Bottom 0.406: v40.64,30.23 40.64,35.56 38.61,37.59 33.53,37.59 28.19,42.93 28.19,57.4 31.75,60.96 40.39,60.96 42.67,63.25 LCD.11
D7  (via drill 0.3)
  Top 0.406: IC5.12 49.53,32 50.8,33.27 R1.2 | IC4.13 66.04,49.53 v62.99,46.48 | v61.98,45.47 61.47,44.96 61.21,44.96 60.45,44.2 60.45,39.12 v57.91,36.58 | EXTIN.6 v29.46,18.03 | EXTOUT.6 79.5,15.75 79.5,16 71.37,24.13 62.99,24.13 62.23,24.89 62.23,25.91 61.47,26.67 v60.45,26.67
  Bottom 0.406: v61.98,45.47 v62.99,46.48 | v57.91,36.58 57.91,34.54 56.9,33.53 50.8,33.53 R1.2 | v29.46,18.03 29.46,20.07 30.73,21.34 35.56,21.34 42.16,27.94 46.99,27.94 IC5.12 49.53,30.23 53.09,26.67 v60.45,26.67
D8
  Bottom 0.406: IC4.14 72.39,46.99 72.39,44.96 74.17,43.18 IC6.9
D9  (via drill 0.3)
  Top 0.406: v57.4,62.74 56.13,61.47 54.1,61.47 52.07,59.44 52.07,57.4 51.31,56.64 40.13,56.64 39.37,57.4 39.37,59.44 40.89,60.96 42.93,60.96 45.21,63.25 LCD.12
  Bottom 0.406: v57.4,62.74 58.67,62.74 59.44,63.5 63.5,63.5 IC4.15
D10  (via drill 0.3)
  Top 0.406: v8.89,40.89 9.14,41.15 9.14,42.67 12.19,45.72 12.19,47.24 IC8.SEL | v97.54,46.99 87.38,46.99 83.82,50.55 83.82,53.85 83.06,54.61 69.85,54.61 IC4.16
  Bottom 0.406: v8.89,40.89 8.89,37.59 10.16,36.32 10.16,29.46 9.4,28.7 9.4,22.61 11.18,20.83 11.18,14.48 24.64,1.02 81.79,1.02 89.92,9.14 89.92,16.51 97.28,23.88 97.28,32 99.06,33.78 99.06,45.47 v97.54,46.99
D+
  Bottom 0.406: RD+.1 36.32,43.18 37.34,42.16 37.59,42.16 44.2,35.56 IC7.2
D-  (via drill 0.3)
  Top 0.406: v41.66,37.08 45.47,37.08 IC7.3
  Bottom 0.406: RD-.1 34.04,43.18 35.81,41.4 37.34,41.4 v41.66,37.08
GND  (via drill 0.3)
  Top 0.813: D3.C 8.13,55.37 12.19,55.37 IC8.GND 12.7,55.37 13.21,55.37 17.27,59.44 17.27,61.21 | 17.27,61.21 17.27,63.25 LCD.1 | LCD.5 27.43,63.25 26.42,62.23 26.42,61.98 25.65,61.21 17.27,61.21 | D2.A 8.38,32.51 8.13,32.77 USB.S2 9.14,32.26 9.14,27.18 10.41,25.91 USB.GND 10.67,25.65 10.67,18.8 10.41,18.54 | 29.72,24.13 C3.- | C2.- 29.72,24.13 | IC2.1 29.72,28.7 29.72,24.13 | 9.65,19.3 8.13,20.83 USB.S1 | 9.65,19.3 10.41,18.54 | 10.41,18.54 12.45,16.51 12.45,15.24 C1.- | J0.2 3.3,12.95 9.65,19.3 | IC5.8 58.42,22.86 60.2,21.08 61.47,21.08 62.23,20.32 62.23,16.51 T7.1 | T1.1 29.21,15.24 EXTIN.5 EXTIN.3 22.61,11.18 20.83,11.18 v20.07,11.94 | EXTOUT.3 EXTOUT.5 81.28,12.7 | 81.28,12.7 RJ45.M1 91.69,12.95 91.69,25.15 91.95,25.4 | 81.28,12.7 J1.1 | R6.2 92.71,28.96 91.69,27.94 RJ45.M2 | RN1.8 91.44,28.19 RJ45.M2 | 91.95,25.4 94.61,22.73 | 94.61,22.73 98.55,18.8 98.55,16.26 RJ45.10 | 91.95,25.4 91.95,27.69 RJ45.M2 | RJ45.12 98.55,26.67 94.61,22.73 | RLCD.2 68.58,60.96 IC6.2 | 82.04,46.99 82.04,48.26 IC6.22 | 82.04,46.99 82.04,45.72 IC6.21 | C8.1 87.12,45.72 85.85,46.99 82.04,46.99 | CX2.2 IC6.11 IC6.18 | IC5.13 44.2,33.27 43.18,33.27 R1.1 | Y1.2 57.15,46.23 56.64,45.72 IC3.7 IC3.2 | IC3.2 IC3.1 IC7.4 | IC3.2 IC3.3 IC3.4
  Bottom 0.813: D2.A IC1.4 | CT.2 27.69,36.83 28.96,35.56 RB.2 31.24,33.78 31.24,30.48 29.46,28.7 IC2.1 | C2.- 21.59,16.76 19.81,16.76 17.53,14.48 | 17.53,14.48 16.76,13.72 14.22,13.72 12.7,15.24 C1.- | D3.C 7.62,50.8 6.35,49.53 6.35,42.93 5.84,42.42 5.84,35.05 7.87,33.02 USB.S2 | T1.1 33.53,15.75 35.56,15.75 36.07,15.24 T2.1 38.61,15.75 40.64,15.75 40.89,15.49 | T3.1 41.15,15.24 40.89,15.49 | T4.1 46.23,15.24 45.97,15.49 | 45.97,15.49 45.72,15.75 41.15,15.75 40.89,15.49 | T5.1 51.31,15.24 51.05,15.49 | 51.05,15.49 50.8,15.75 46.23,15.75 45.97,15.49 | T6.1 56.39,15.24 56.13,15.49 | 56.13,15.49 55.88,15.75 51.31,15.75 51.05,15.49 | 56.13,15.49 56.39,15.75 60.71,15.75 60.96,15.49 63.25,15.49 T7.1 64.01,15.75 66.04,15.75 66.55,15.24 T8.1 68.83,15.49 69.34,15.49 74.42,20.57 74.42,24.13 74.68,24.38 | 86.36,59.69 88.39,59.69 89.15,58.93 91.44,58.93 C6.- | 86.11,59.94 C7.1 | 86.36,59.69 86.11,59.94 | 86.36,59.69 86.36,46.99 C8.1 87.38,45.47 87.38,44.96 86.36,43.94 86.36,42.42 84.84,40.89 | IC6.2 79.25,60.96 80.52,59.69 85.85,59.69 86.11,59.94 | CX1.2 71.12,45.21 69.85,43.94 69.85,39.37 CX2.2 71.12,35.56 | 71.12,35.56 JP1.10 74.68,24.38 | 74.68,24.38 ISP.6 | C4.2 39.88,46.99 41.15,48.26 43.18,48.26 C5.2 44.7,47.24 45.21,47.24 46.74,48.77 51.31,48.77 IC4.8 | IC4.22 50.8,53.34 IC4.8 | IC5.13 46.99,33.02 IC7.4 | IC4.8 55.37,52.83 56.39,52.83 57.15,52.07 Y1.2 | 71.12,35.56 IC3.4 | 84.84,40.89 82.04,38.1 IC6.18 | RN1.8 90.17,35.56 84.84,40.89 | 17.53,14.48 v20.07,11.94
  pour Top (isolate 0.406, hatched): 0,73.66 100.33,73.66 100.33,0 0,0
  pour Bottom (isolate 0.406, hatched): 0,73.66 100.33,73.66 100.33,0 0,0
INT0  (via drill 0.3)
  Top 0.406: IC4.4 41.4,52.58 32,52.58 30.48,51.05 30.48,50.8 29.21,49.53 28.45,49.53 IC8.IRQ 28.19,49.53 27.43,49.53 24.89,52.07 v14.73,52.07 | JP1.5 66.04,26.16 64.77,27.43 64.77,28.45 v61.98,31.24 | v59.69,33.53 53.85,33.53 v52.83,34.54 | v25.91,39.12 v52.83,39.12
  Bottom 0.406: v59.69,33.53 v61.98,31.24 | v52.83,39.12 v52.83,34.54 | v25.91,39.12 24.13,40.89 16,40.89 14.73,42.16 v14.73,52.07
INT1  (via drill 0.3)
  Top 0.406: IC4.5 45.72,46.48 v46.23,45.97 | v52.83,42.16 v51.31,43.69 | v64.01,30.99 64.77,30.99 67.31,28.45 67.31,26.67 JP1.7
  Bottom 0.406: v46.23,45.97 46.48,45.97 47.24,45.21 49.78,45.21 v51.31,43.69 | v52.83,42.16 52.83,40.13 55.63,37.34 59.69,37.34 60.45,36.58 60.45,34.54 v64.01,30.99
MISO  (via drill 0.3)
  Top 0.406: v37.59,47.24 28.45,47.24 IC8.SDO | 64.9,54.48 65.79,53.59 71.37,53.59 74.17,50.8 IC6.6 | 64.9,54.48 IC4.18 | ISP.1 82.55,26.92 86.36,30.73 86.36,36.07 83.06,39.37 80.77,39.37 v78.49,41.66 | IC7.6 47.75,43.18 49.02,44.45 51.82,44.45 v52.83,43.43 | v52.83,48.01 54.61,49.78 54.61,51.82 55.37,52.58 58.93,52.58 59.69,51.82 59.69,49.78 60.45,49.02 64.01,49.02 64.77,49.78 64.77,54.36 64.9,54.48
  Bottom 0.406: v37.59,47.24 40.39,44.45 45.72,44.45 IC7.6 | v78.49,41.66 78.49,47.5 75.18,50.8 IC6.6 | v52.83,43.43 v52.83,48.01
MOSI  (via drill 0.3)
  Top 0.406: v41.15,45.21 27.94,45.21 21.84,51.31 12.45,51.31 IC8.SDI | v68.33,52.83 68.83,52.83 70.99,50.67 | 70.99,50.67 73.41,48.26 IC6.7 | v75.44,22.1 72.39,25.15 72.39,25.91 71.63,26.67 v70.61,26.67 | v67.31,34.54 67.31,37.08 65.53,38.86 65.53,42.67 | 65.53,42.67 65.53,45.21 70.99,50.67 | IC7.5 50.8,43.18 52.58,41.4 v55.63,41.4 | v64.26,42.67 65.53,42.67
  Bottom 0.406: v41.15,45.21 46.23,45.21 46.99,44.45 48.26,44.45 IC7.5 | IC4.17 63.5,57.66 v68.33,52.83 | ISP.4 77.72,24.38 v75.44,22.1 | v70.61,26.67 69.85,27.43 69.85,32 v67.31,34.54 | v55.63,41.4 62.99,41.4 v64.26,42.67
N$1
  Top 1.27: 11.68,59.69 11.68,70.87 arc-90 12.7,71.88 88.14,71.88
N$2
  Top 0.406: IC4.9 X1.2 55.88,47.75 54.61,46.48 Y1.1
N$3
  Top 0.406: RN2.2 33.02,16.76 33.53,16.76 34.8,15.49 34.8,13.97 T1.2
N$4
  Bottom 0.406: IC5.5 51.56,20.83 54.1,20.83 RN3.3
N$5
  Top 0.406: IC5.6 54.1,20.83 59.18,20.83 RN3.5
N$6
  Bottom 0.813: J2.2 2.03,38.35 4.32,36.07 4.32,18.8 J0.1
N$7
  Bottom 0.406: IC5.7 56.64,20.83 64.26,20.83 RN3.7
N$8
  Top 0.406: IC4.10 X1.1 58.42,47.75 59.69,46.48 Y1.3
N$9
  Top 0.813: RSC.2 10.16,42.42 12.95,45.21 16.51,45.21 IC1.6 18.8,42.93 18.8,39.37 19.81,38.35 19.81,34.29 24.38,29.72 25.65,29.72 D1.C
  Bottom 0.813: C1.+ 16.26,15.24 25.65,24.64 D1.C
N$10
  Top 0.406: RN3.1 IC5.4
N$11
  Top 0.406: RN2.7 43.43,21.84 IC5.3
N$12
  Top 0.406: RN2.5 41.91,22.61 IC5.2
N$13
  Top 0.406: RN2.3 37.08,22.86 IC5.1
N$14
  Bottom 0.406: RN2.1 28.19,20.57 36.32,28.7 40.13,28.7 IC5.15
N$15
  Top 0.406: RN2.4 38.1,16.76 38.61,16.76 39.88,15.49 39.88,13.97 T2.2
N$16
  Top 0.813: T1.3 33.02,4.57 S12.1
N$17
  Top 0.813: T2.3 38.1,4.57 36.83,3.3 S12.2
N$18
  Top 0.813: T3.3 43.18,4.57 S34.1
N$19
  Top 0.406: RN2.6 43.18,16.76 43.69,16.76 44.96,15.49 44.96,13.97 T3.2
N$20
  Top 0.813: T4.3 48.26,4.57 46.99,3.3 S34.2
N$21
  Top 0.406: RN2.8 46.48,19.05 50.04,15.49 50.04,13.97 T4.2
N$22
  Top 0.813: T5.3 53.34,4.57 S56.1
N$23
  Top 0.813: T6.3 58.42,4.57 57.15,3.3 S56.2
N$24
  Top 0.813: T7.3 63.5,4.57 S78.1
N$25
  Top 0.813: T8.3 68.58,4.57 67.31,3.3 S78.2
N$26
  Top 0.406: RN3.2 53.34,17.27 55.12,15.49 55.12,13.97 T5.2
N$27
  Top 0.406: RN3.4 58.42,17.27 60.2,15.49 60.2,13.97 T6.2
N$28
  Top 0.406: RN3.6 63.5,17.27 65.28,15.49 65.28,13.97 T7.2
N$29
  Top 0.406: RN3.8 68.58,17.27 70.36,15.49 70.36,13.97 T8.2
N$30  (via drill 0.3)
  Top 0.406: C8.2 R4.2 R5.1 87.63,37.08 89.66,35.05 89.66,14.73 89.41,14.48 v86.36,14.48 | L2.1 83.82,20.32 85.6,22.1 RJ45.6
  Bottom 0.406: v86.36,14.48 81.28,19.56 L2.1
N$31
  Top 0.813: PTC.P$1 7.37,36.58 2.03,36.58 J2.3
N$32
  Top 0.406: RN1.3 RN1.2 93.47,52.83 93.47,54.36 94.49,55.37 97.28,55.37 B1.1
N$33
  Bottom 0.406: RN1.6 97.54,34.54 B3.1
N$34
  Top 0.406: D4.C 36.07,33.02 IC2.2
N$35
  Top 0.406: RN1.5 91.44,45.21 | 91.44,45.21 97.28,45.21 B2.1 | 91.44,45.21 RN1.4
N$36
  Top 0.406: RLED.1 5.08,57.15 LED.K
N$38
  Top 0.406: RD+.2 35.05,35.56 29.46,29.97 27.94,29.97 26.16,28.19 21.34,28.19 18.54,30.99 13.72,30.99 10.92,28.19 USB.D+
N$39
  Top 0.406: RLED.2 D3.A
  Bottom 0.406: D3.A 7.62,48.51 22.35,63.25 LCD.3
N$40
  Top 0.813: 13.46,38.1 IC1.8 IC1.7 | IC1.1 13.46,38.1 | 13.46,38.1 RSC.1
N$41
  Top 0.406: R5.2 88.14,35.05 88.14,23.62 RJ45.7
  Bottom 0.406: R5.2 86.36,36.83 84.84,36.83 83.57,35.56 IC6.17
N$42
  Top 0.406: R4.1 82.55,33.02 IC6.16
  Bottom 0.406: RJ45.8 85.6,24.89 85.6,28.96 83.82,30.73 83.82,31.24 82.04,33.02 IC6.16
N$43  (via drill 0.3)
  Top 0.406: v80.77,34.29 79.5,33.02 IC6.13
  Bottom 0.406: v80.77,34.29 83.57,34.29 88.01,29.84 | 88.01,29.84 89.66,28.19 89.66,17.27 88.39,16 RJ45.1 | R3.2 87.63,47.24 89.66,45.21 89.66,37.59 90.42,36.83 92.46,36.83 93.22,36.07 93.22,35.05 88.01,29.84
N$44  (via drill 0.3)
  Top 0.406: v78.74,37.08 77.22,35.56 IC6.12 | v73.15,28.19 73.15,25.4 81.28,17.27 85.6,17.27 RJ45.2
  Bottom 0.406: v78.74,37.08 78.74,39.88 80.77,41.91 83.06,41.91 83.82,42.67 83.82,49.53 R2.1 | v73.15,28.19 73.15,29.21 72.39,29.97 72.39,33.78 74.17,35.56 IC6.12
N$45  (via drill 0.3)
  Top 0.406: RD-.2 34.04,35.56 35.18,36.7 | 35.18,36.7 35.31,36.83 36.83,36.83 R7.1 | v23.88,33.53 23.88,34.04 26.67,36.83 35.05,36.83 35.18,36.7
  Bottom 0.406: v23.88,33.53 18.54,28.19 12.95,28.19 USB.D-
N$46
  Bottom 0.813: IC1.2 18.03,37.59 21.59,37.59 22.86,36.32 22.86,36.07 25.65,33.27 D2.C 16.76,23.62 16.76,22.86 L1.1
N$47
  Top 0.406: JP3.1 85.09,4.32 86.11,3.3 J1.2
N$48
  Bottom 0.406: RLCD.1 59.44,61.98 56.9,61.98 55.63,63.25 LCD.16
N$49  (via drill 0.3)
  Top 0.406: IC1.3 18.54,38.1 v18.03,38.61
  Bottom 0.406: v18.03,38.61 23.37,38.61 CT.1
N$50
  Bottom 0.406: C6.+ 91.44,60.71 89.41,60.71 87.88,62.23 75.69,62.23 74.42,63.5 IC6.1
N$51
  Top 0.406: IC6.14 79.5,30.48 80.77,29.21 83.31,29.21 85.09,30.99 R6.1
N$52
  Top 0.406: 69.98,44.32 CX1.1 | 69.98,44.32 69.85,44.45 X2.1 | IC6.24 81.79,53.34 76.2,47.75 76.2,45.21 75.44,44.45 70.1,44.45 69.98,44.32
N$53
  Top 0.406: 69.98,39.5 CX2.1 | 69.98,39.5 69.85,39.37 X2.2 | IC6.23 80.26,50.8 76.96,47.5 76.96,40.89 75.44,39.37 70.1,39.37 69.98,39.5
N$54
  Top 0.406: R2.2 R3.1 C7.2
N$55
  Top 0.406: RB.1 RT.2 JP2.1 IC1.5
QH*
  Top 0.406: IC5.9 57.15,27.43 61.72,22.86 71.63,22.86 78.74,15.75 78.74,14.73 77.98,13.97 76.2,13.97 EXTOUT.2
RESET  (via drill 0.3)
  Top 0.406: JP1.8 69.34,27.94 70.48,29.08 | 70.48,29.08 70.61,29.21 73.66,29.21 ISP.5 | RRST.2 IC4.1 | v69.85,36.58 70.36,36.07 70.36,29.21 70.48,29.08 | v55.63,38.35 41.91,38.35 40.89,37.34 40.89,36.58 IC7.1
  Bottom 0.406: ISP.5 76.96,27.94 76.96,38.1 74.42,40.64 IC6.10 | IC7.1 36.83,40.64 34.04,40.64 31.75,42.93 RRST.2 | v69.85,36.58 62.99,36.58 61.21,38.35 v55.63,38.35
RXD  (via drill 0.3)
  Top 0.406: IC4.2 38.1,49.78 40.64,47.24 40.64,46.74 41.91,45.47 41.91,44.96 40.64,43.69 v40.64,42.42 | v43.18,39.88 v55.63,39.88 | v69.09,37.34 v69.09,30.99
  Bottom 0.406: v43.18,39.88 v40.64,42.42 | v55.63,39.88 64.52,39.88 67.06,37.34 v69.09,37.34 | v69.09,30.99 JP1.6
SCK  (via drill 0.3)
  Top 0.406: IC8.SCK 12.45,49.28 22.86,49.28 27.69,44.45 30.23,44.45 34.8,39.88 40.89,39.88 44.2,43.18 IC7.7 45.21,43.18 47.75,40.64 v55.12,40.64 | v69.85,48.51 72.64,45.72 IC6.8
  Bottom 0.406: v69.85,48.51 66.04,48.51 65.66,48.9 | 65.66,48.9 64.77,49.78 64.77,52.07 IC4.19 | ISP.3 77.72,26.92 76.45,25.65 75.44,25.65 74.68,26.42 74.68,28.45 76.2,29.97 76.2,36.07 75.44,36.83 73.15,36.83 72.39,37.59 72.39,41.15 73.15,41.91 75.44,41.91 76.2,42.67 76.2,43.94 74.42,45.72 IC6.8 | v55.12,40.64 63.25,40.64 65.53,42.93 65.53,48.77 65.66,48.9
SCL  (via drill 0.3)
  Top 0.406: IC4.28 38.1,55.88 v52.58,55.88 | v64.77,34.54 64.77,41.15 62.99,42.93 62.99,45.47 62.23,46.23 61.47,46.23 59.18,43.94 IC3.6
  Bottom 0.406: v52.58,55.88 55.63,55.88 59.69,51.82 59.69,48.26 61.21,46.74 61.21,45.21 IC3.6 | JP1.3 63.5,26.16 64.77,27.43 v64.77,34.54
SDA  (via drill 0.3)
  Top 0.406: IC3.5 61.72,37.85 62.99,36.58 62.99,33.27 59.69,29.97 59.69,26.42 60.71,25.4 JP1.1 | v47.5,52.58 49.28,52.58 v51.82,55.12
  Bottom 0.406: IC4.27 36.32,60.2 32,60.2 30.48,58.67 30.48,58.17 36.07,52.58 v47.5,52.58 | v51.82,55.12 51.82,56.13 52.32,56.64 57.4,56.64 62.23,51.82 62.23,48.26 63.75,46.74 63.75,45.21 IC3.5
TXD  (via drill 0.3)
  Top 0.406: v39.12,43.94 39.62,43.43 v39.62,42.42 | v46.74,37.59 48.26,36.07 48.26,33.27 v49.02,32.51
  Bottom 0.406: IC4.3 37.85,48.01 37.34,48.01 36.83,47.5 36.83,46.23 v39.12,43.94 | v39.62,42.42 44.45,37.59 v46.74,37.59 | v49.02,32.51 50.04,32.51 50.29,32.26 59.18,32.26 JP1.4
VCC  (via drill 0.3)
  Top 0.406: RRST.1 28.96,61.21 28.96,64.26 28.19,65.02 17.02,65.02 16.26,64.26 16.26,60.71 12.95,57.4 12.45,57.4 IC8.VDD | C4.1 41.91,46.48 42.67,45.72 42.67,45.21 | 42.67,45.21 42.67,43.94 IC7.8 | 50.93,46.35 50.8,46.48 IC4.7 50.8,51.56 55.88,56.64 IC4.20 | IC3.8 50.93,46.35 | 42.67,45.21 49.78,45.21 50.93,46.35 | IC6.20 82.04,43.18 82.04,40.64 IC6.19 | 83.82,55.88 88.9,55.88 RN1.1 | IC6.25 83.82,55.88 | 83.82,55.88 83.82,61.72 82.04,63.5 IC6.28 | 35.31,26.42 35.31,27.43 34.04,28.7 IC2.3 | 35.31,26.42 C3.+ 34.04,22.86 27.43,22.86 20.32,15.75 20.32,14.73 21.59,13.46 EXTIN.1 | 35.31,26.42 IC5.16 | L2.2 71.12,16.51 EXTOUT.1 | v63.25,37.34 64.01,36.58 64.01,34.29 64.52,33.78 67.56,33.78 68.33,34.54 68.33,37.59 68.83,38.1 69.34,38.1 72.39,35.05 72.39,32.51 73.15,31.75 80.52,31.75 81.79,30.48 IC6.15
  Bottom 0.406: IC7.8 R7.2 | RRST.1 32.26,58.42 37.34,53.34 48.26,53.34 IC4.7 | IC6.19 81.79,40.64 80.01,38.86 80.01,32.26 81.79,30.48 IC6.15 82.04,30.48 82.04,27.69 82.3,27.43 82.3,23.11 76.2,17.02 76.2,13.97 EXTOUT.1 74.42,12.7 63.5,1.78 30.48,1.78 21.59,10.67 EXTIN.1 | IC6.20 81.79,43.18 80.01,44.96 80.01,54.1 81.79,55.88 IC6.25 | IC5.10 57.15,27.94 JP1.2 60.96,27.18 62.23,25.91 62.23,24.89 66.29,20.83 70.61,20.83 L2.2 | IC3.8 54.1,40.39 55.37,39.12 61.47,39.12 v63.25,37.34
VIN  (via drill 0.3)
  Top 0.406: RT.1 26.92,35.31 D4.A 28.96,33.53 v30.99,35.56 | C2.+ 22.86,24.13 21.59,22.86 L1.2 | JP4.1 LED.A
  Bottom 0.406: USB.VBUS 12.95,25.65 12.95,24.64 16,21.59 20.32,21.59 21.34,22.61 L1.2 | D4.A 29.21,31.75 26.92,29.46 C2.+ | JP4.1 16.26,59.69 19.81,63.25 LCD.2 20.07,63.5 21.59,65.02 23.88,65.02 | 23.88,65.02 51.31,65.02 52.83,63.5 LCD.15 53.09,63.25 55.37,60.96 63.25,60.96 64.77,59.44 64.77,57.4 72.64,49.53 75.44,49.53 77.72,47.24 77.72,33.53 79.76,31.5 79.76,26.42 81.03,25.15 ISP.2 | v30.99,35.56 24.89,41.66 23.62,41.66 22.61,42.67 22.61,60.96 23.88,62.23 23.88,65.02

### Text on the board
tNames: OpenSprinkler (v1.2u) | Rayshobby, Apr 2012 | VIN | 1N4148 | MEGA328 | RFM12B | PwrSen | ENC28J60 | 34063 | TINY45 | 24LC | 1N4148 | 1N5819 | VCC TXD RXD RST GND | 1N4001 | USB | 74HC595 | SDA SCL D2 D3 A1 | RJ45 | DIN CLK LAT | DOUT CLK LAT | 100u | AC IN | VCC GND GND | VCC GND GND | RAIN | SEN | 1 | 2 | 3 | 4 | 5 | 6 | 7 | 8
BoxDim: Serpac WM-032RC Enclosure | All units are in inch | Left | Right | Front | 0.14 | 0.32 | 1.28 | 0.91 | 0.32 | 1.0 | 0.26 | 0.4 | 0.29 | 3.25 | 0.45 | 0.7 | 0.53 | 0.4 | 0.32 | 0.63 | Bottom | 1.28 | 0.32 | 1.6 | 1.6 | 4.38